# Altium schematic sheet Slave.SchDoc
size A
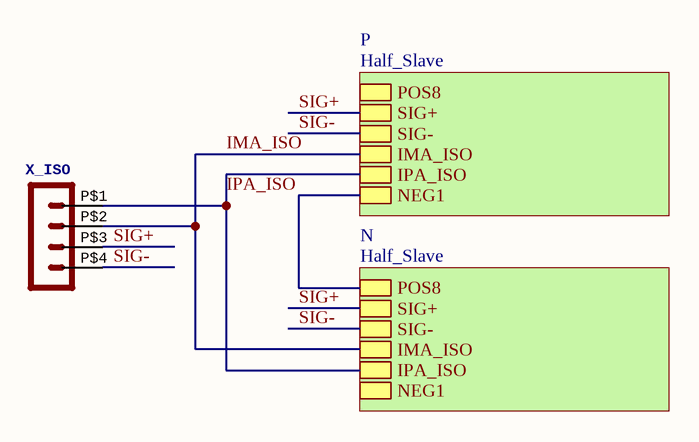
[diagram p0: Slave.SchDoc]

## Parts
X_ISO  Molex - Micro-Fit 3.0 Series connector,  3.00mm (0.118") pitch header, 4 positions.  [43650-0424]  (value not drawn)

## Sub-sheets
N = Half_Slave: POS8, IMA_ISO, IPA_ISO, NEG1, SIG+, SIG-
P = Half_Slave: POS8, IMA_ISO, IPA_ISO, NEG1, SIG+, SIG-

## Nets
IMA_ISO: X_ISO.P$2 ; sheet P/IMA_ISO, sheet N/IMA_ISO
IPA_ISO: X_ISO.P$1 ; sheet P/IPA_ISO, sheet N/IPA_ISO
SIG+: X_ISO.P$3 ; sheet P/SIG+, sheet N/SIG+
SIG-: X_ISO.P$4 ; sheet P/SIG-, sheet N/SIG-
(unnamed): sheet P/NEG1, sheet N/POS8

## Library data of the parts
X_ISO = POS4_MF43650-0424: GateName_1: G$1; SymbolName_1: HEADER_POS4; DeviceSetName: HEADER_POS4_?; DeviceName: 43650-0424; LibraryName: MOLEX Micro-Fit; Package: 43650-0424